# Altium schematic sheet Voltage Sense.SchDoc
size A
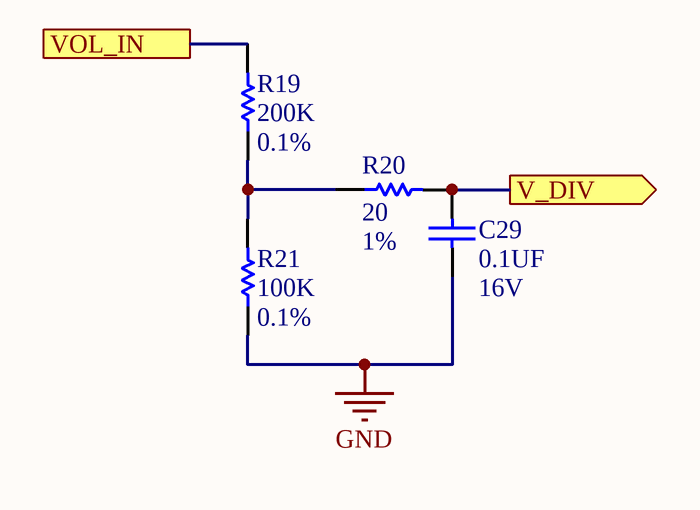
[diagram p0: Voltage Sense.SchDoc]

## Parts
C29  Val: 0.1UF  Vol: 16V  [0603_CAP]  (hidden comment: CAP 0603 0.1UF 16V 10% X7R)
R19  Val: 200K  Tol: 0.1%  [0603_RES]  (hidden comment: RES 0603 200K 0.1%)
R20  Val: 20  Tol: 1%  [0603_RES]  (hidden comment: RES 0603 20 1%)
R21  Val: 100K  Tol: 0.1%  [0603_RES]  (hidden comment: RES 0603 100K 0.1%)

## Ports
V_DIV (out), VOL_IN

## Nets
GND: C29.1 R21.1
V_DIV: C29.2 R20.2 ; port V_DIV
VOL_IN: R19.2 ; port VOL_IN
NetR19_1: R19.1 R20.1 R21.2

## Library data of the parts
C29 = CAP 0603 0.1UF 16V 10% X7R: Capacitor Surface Mount 0603 Footprint 0.1UF 16V 10% Tolerance Ceramic X7R; Manufacturer: Various; PCB Package: 0603; Description in Visual: Cap SMT 0603 0.1UF 16V 10%  Cer X7R; P/N: CAP 0603 0.1UF 16V 10% X7R; Manufacturer P/N: Various; Value: 0.1UF; Voltage: 16V; Tolerance: 10%; Type: Ceramic X7R; ComponentLink1Description: Manufacturer Website; ComponentLink2Description: Component Datasheet; ComponentLink3Description: Octopart Link
R19 = RES 0603 200K 0.1%: Resistor Surface Mount, 200K Ohms, 0603 Footprint, 0.1% Tolerance 0.1W; Manufacturer: Various; PCB Package: 0603; Description in Visual: Res SMT 200K 0603  0.1%  0.1W; P/N: RES 0603 200K 0.1%; Manufacturer P/N: Various; Value: 200K; Power_Rating: 0.1W; Tolerance: 0.1%
R20 = RES 0603 20 1%: Resistor Surface Mount, 20 Ohms, 0603 Footprint, 1% Tolerance 0.1W; Manufacturer: Various; PCB Package: 0603; Description in Visual: Res SMT 20 0603  1%  0.1W; Value: 20; P/N: RES 0603 20 1%; Manufacturer P/N: Various; Power_Rating: 0.1W; Tolerance: 1%
R21 = RES 0603 100K 0.1%: Resistor Surface Mount, 100K Ohms, 0603 Footprint, 0.1% Tolerance 0.1W; Manufacturer: Various; PCB Package: 0603; Description in Visual: Res SMT 100K 0603  0.1%  0.1W; P/N: RES 0603 100K 0.1%; Manufacturer P/N: Various; Value: 100K; Power_Rating: 0.1W; Tolerance: 0.1%